# Altium schematic sheet FS-01.SchDoc
size A4
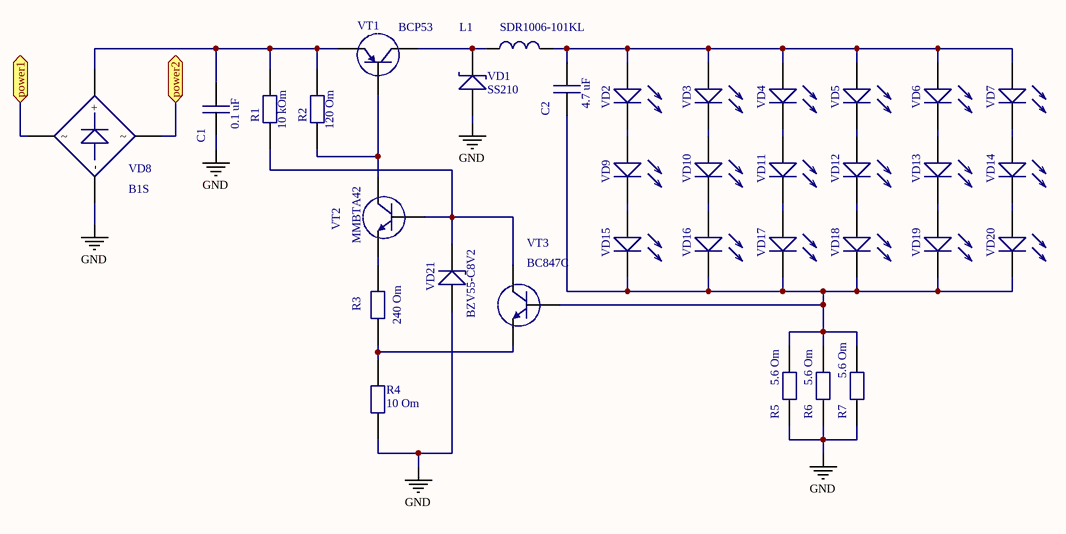
[diagram p0: FS-01.SchDoc]

## Parts
C1  value 0.1 uF  [CAP1206]  (hidden comment: Capacitor)
C2  value 4.7 uF  [CAP1206]  (hidden comment: Capacitor)
L1  value SDR1006-101KL  [SDR1006]  (hidden comment: coil)
R1  value 10 kOm  [RES1206]  (hidden comment: Resistor)
R2  value 120 Om  [RES1206]  (hidden comment: Resistor)
R3  value 240 Om  [RES1206]  (hidden comment: Resistor)
R4  value 10 Om  [RES1206]  (hidden comment: Resistor)
R5  value 5.6 Om  [RES1206]  (hidden comment: Resistor)
R6  value 5.6 Om  [RES1206]  (hidden comment: Resistor)
R7  value 5.6 Om  [RES1206]  (hidden comment: Resistor)
VD1  value SS210  [SMB1]  (hidden comment: Schottky)
VD2  LED  [LED_SAKURA]  (value not drawn)
VD3  LED  [LED_SAKURA]  (value not drawn)
VD4  LED  [LED_SAKURA]  (value not drawn)
VD5  LED  [LED_SAKURA]  (value not drawn)
VD6  LED  [LED_SAKURA]  (value not drawn)
VD7  LED  [LED_SAKURA]  (value not drawn)
VD8  value B1S  [db-1ms]  (hidden comment: Diode Bridge)
VD9  LED  [LED_SAKURA]  (value not drawn)
VD10  LED  [LED_SAKURA]  (value not drawn)
VD11  LED  [LED_SAKURA]  (value not drawn)
VD12  LED  [LED_SAKURA]  (value not drawn)
VD13  LED  [LED_SAKURA]  (value not drawn)
VD14  LED  [LED_SAKURA]  (value not drawn)
VD15  LED  [LED_SAKURA]  (value not drawn)
VD16  LED  [LED_SAKURA]  (value not drawn)
VD17  LED  [LED_SAKURA]  (value not drawn)
VD18  LED  [LED_SAKURA]  (value not drawn)
VD19  LED  [LED_SAKURA]  (value not drawn)
VD20  LED  [LED_SAKURA]  (value not drawn)
VD21  value BZV55-C8V2  [minimelf]  (hidden comment: Zenner)
VT1  value BCP53  [SOT223]  (hidden comment: PNP)
VT2  value MMBTA42  [SOT 23]  (hidden comment: NPN)
VT3  value BC847C  [SOT 23]  (hidden comment: NPN)

## Ports
power1, power2

## Nets
GND: C1.1 R4.1 R5.1 R6.1 R7.1 VD1.2 VD8.2(-) VD21.2
power1: VD8.3 ; port power1
power2: VD8.4 ; port power2
NetC1_2: C1.2 R1.2 R2.1 VD8.1(+) VT1.E
NetC2_1: C2.1 R5.2 R6.2 R7.2 VD15.1 VD16.1 VD17.1 VD18.1 VD19.1 VD20.1 VT3.B
NetC2_2: C2.2 L1.2 VD2.2 VD3.2 VD4.2 VD5.2 VD6.2 VD7.2
NetL1_1: L1.1 VD1.1 VT1.K
NetR1_1: R1.1 VD21.1 VT2.B VT3.K
NetR2_2: R2.2 VT1.B VT2.K
NetR3_1: R3.1 R4.2 VT3.E
NetR3_2: R3.2 VT2.E
NetVD2_1: VD2.1 VD9.2
NetVD3_1: VD3.1 VD10.2
NetVD4_1: VD4.1 VD11.2
NetVD5_1: VD5.1 VD12.2
NetVD6_1: VD6.1 VD13.2
NetVD7_1: VD7.1 VD14.2
NetVD9_1: VD9.1 VD15.2
NetVD10_1: VD10.1 VD16.2
NetVD11_1: VD11.1 VD17.2
NetVD12_1: VD12.1 VD18.2
NetVD13_1: VD13.1 VD19.2
NetVD14_1: VD14.1 VD20.2

## Library data of the parts
VD2-VD7 VD9-VD20 = LED: Value: SEL-2835-R62-2V060
VT1 = PNP: pin to pad: B>1 E>3 K>2
VT2 VT3 = NPN: pin to pad: B>1 E>2 K>3